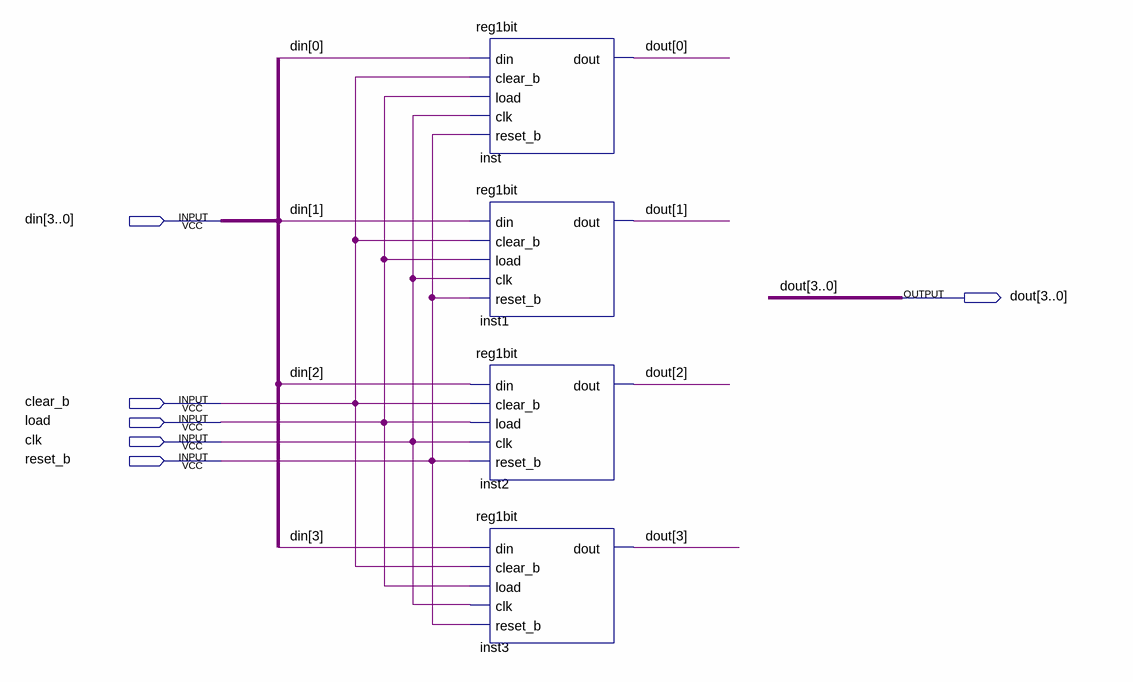
[diagram p0: schematic sheet]
// Quartus schematic reg4bit.bdf as structural Verilog: 4 symbols, 6 pins
module reg4bit (
  input  [3:0] din,
  input  clear_b,
  input  load,
  input  clk,
  input  reset_b,
  output [3:0] dout
);

  reg1bit inst (.din(din[0]), .clear_b(clear_b), .load(load), .clk(clk), .reset_b(reset_b), .dout(dout[0]));
  reg1bit inst1 (.din(din[1]), .clear_b(clear_b), .load(load), .clk(clk), .reset_b(reset_b), .dout(dout[1]));
  reg1bit inst2 (.din(din[2]), .clear_b(clear_b), .load(load), .clk(clk), .reset_b(reset_b), .dout(dout[2]));
  reg1bit inst3 (.din(din[3]), .clear_b(clear_b), .load(load), .clk(clk), .reset_b(reset_b), .dout(dout[3]));
endmodule
